# Altium project Counter_circuit.PrjPcb
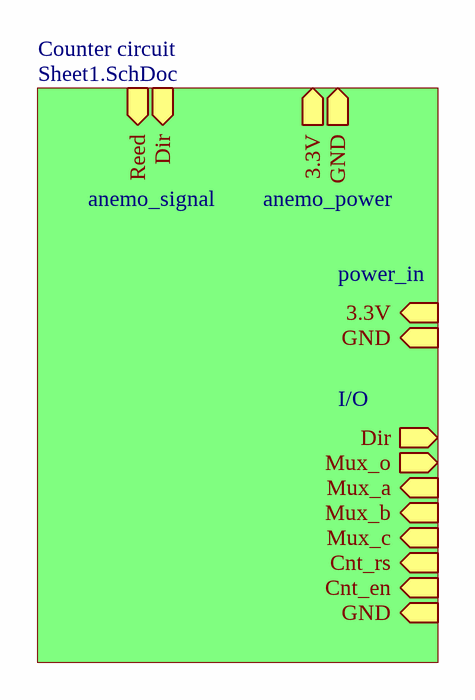
[diagram p0: Sheet2.SchDoc]
2 sheets, 36 parts. Net scope: hierarchical (ports join the sheet entries above them; power ports are global).
Board file: PCB1.PcbDoc
Sheets:
  Sheet2.SchDoc
    Counter circuit = Sheet1.SchDoc

## Sheet Sheet2.SchDoc: Counter circuit
size A4; ApprovedBy: alexander.marinsek@gmail.com; Author: Alexander Marinšek; Revision: 1.0; SheetNumber: 2; SheetTotal: 2

### Sub-sheets
Counter circuit = Sheet1.SchDoc: Mux_b (in), Mux_o (out), Dir (out), GND (out), Dir (in), 3.3V (in), Reed (in), Cnt_rs (in), 3.3V (out), Cnt_en (in), Mux_a (in), GND (in), Mux_c (in), GND (in)

### Nets
anemo_vcc: sheet Counter circuit/3.3V, sheet Counter circuit/3.3V
GND: sheet Counter circuit/GND, sheet Counter circuit/GND, sheet Counter circuit/GND
anemo_analog: sheet Counter circuit/Dir, sheet Counter circuit/Dir

### Notes on the sheet
- anemo_signal
- anemo_power
- power_in
- I/O
- Title
- Size:
- Date:
- A4
- Revision:
- Sheet
- of
- Author:
- Contact:

## Sheet Sheet1.SchDoc: Counter circuit
size A4; ApprovedBy: alexander.marinsek@gmail.com; Author: Alexander Marinšek; Revision: 1.0; SheetNumber: 1; SheetTotal: 2
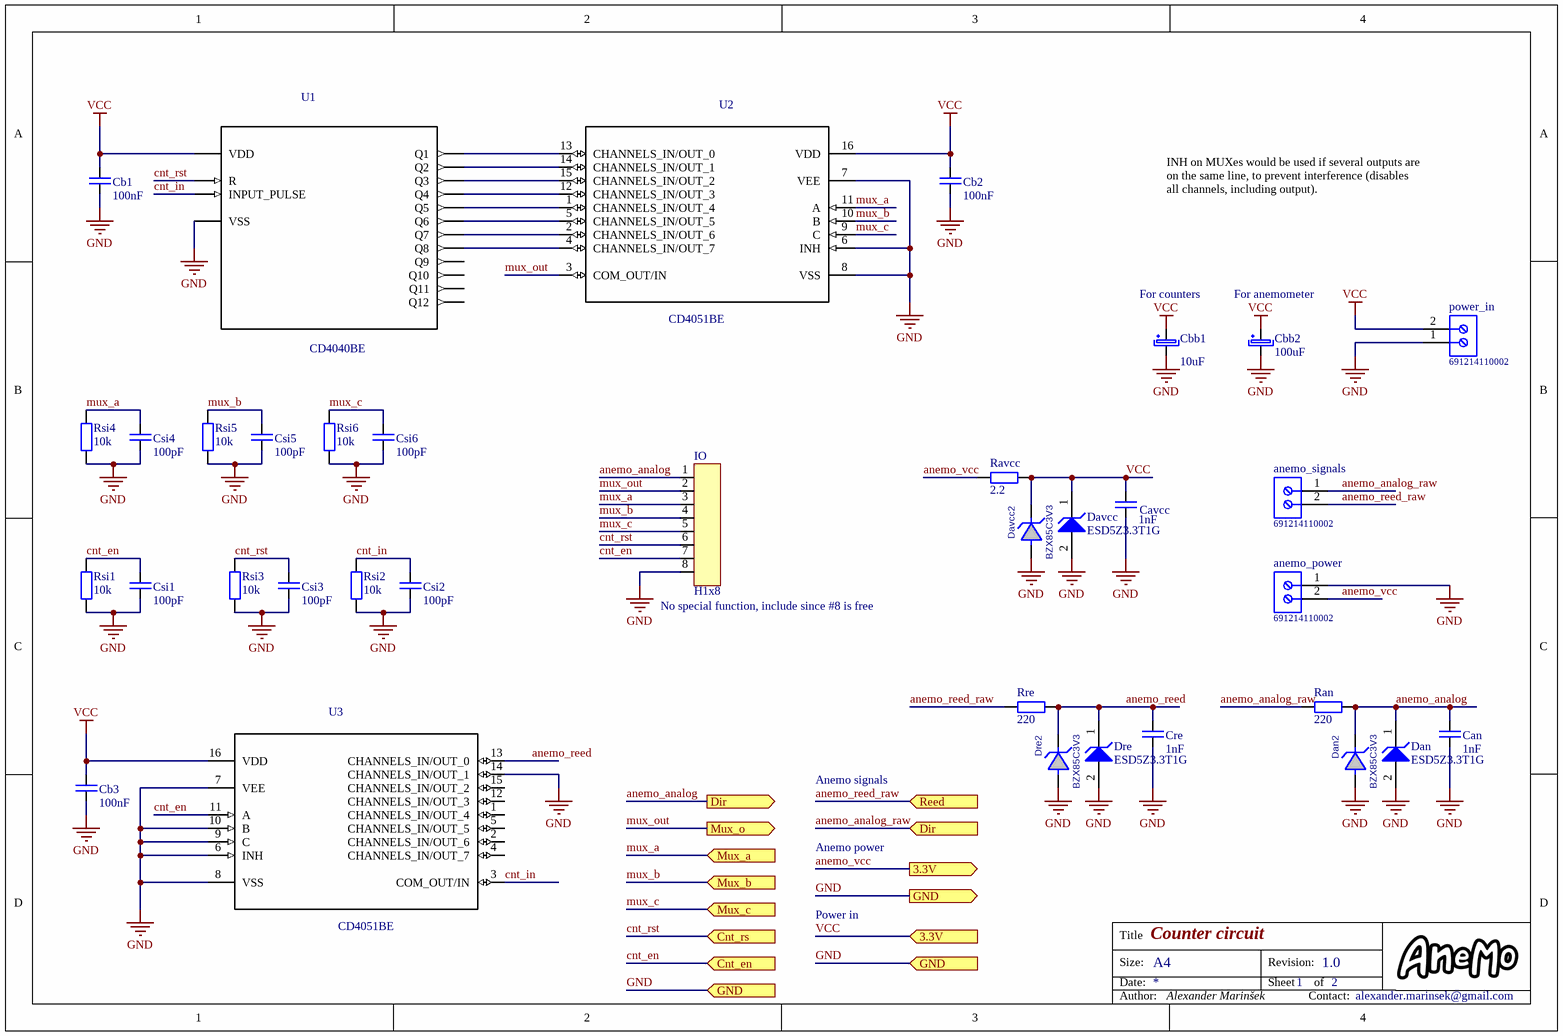
[diagram p1: Sheet1.SchDoc]

### Parts
anemo_power  691214110002  [691214110002]
anemo_signals  691214110002  [691214110002]
Can  1nF  [C0805(2012)_M]
Cavcc  1nF  [C0805(2012)_M]
Cb1  100nF  [C0805(2012)_M]
Cb2  100nF  [C0805(2012)_M]
Cb3  100nF  [C0805(2012)_M]
Cbb1  10uF  [C-SMD-ELKO-D]
Cbb2  100uF  [C-SMD-ELKO-D]
Cre  1nF  [C0805(2012)_M]
Csi1  100pF  [C0805(2012)_M]
Csi2  100pF  [C0805(2012)_M]
Csi3  100pF  [C0805(2012)_M]
Csi4  100pF  [C0805(2012)_M]
Csi5  100pF  [C0805(2012)_M]
Csi6  100pF  [C0805(2012)_M]
Dan  ESD5Z3.3T1G  [ONSC-SOD-523-2-502-01_V]
Dan2  BZX85C3V3  [DO 35 (300MILS)]
Davcc  ESD5Z3.3T1G  [ONSC-SOD-523-2-502-01_V]
Davcc2  BZX85C3V3  [DO 35 (300MILS)]
Dre  ESD5Z3.3T1G  [ONSC-SOD-523-2-502-01_V]
Dre2  BZX85C3V3  [DO 35 (300MILS)]
IO  H1x8  [H1x8]
power_in  691214110002  [691214110002]
Ran  220  [R0805(2012)_M]
Ravcc  2.2  [R0805(2012)_M]
Rre  220  [R0805(2012)_M]
Rsi1  10k  [R0805(2012)_M]
Rsi2  10k  [R0805(2012)_M]
Rsi3  10k  [R0805(2012)_M]
Rsi4  10k  [R0805(2012)_M]
Rsi5  10k  [R0805(2012)_M]
Rsi6  10k  [R0805(2012)_M]
U1  CD4040BE  [*SOIC16]
U2  CD4051BE  [*SOIC16]
U3  CD4051BE  [*SOIC16]

### Ports
3.3V (in), 3.3V (out), Cnt_en (in), Cnt_rs (in), Dir (in), Dir (out), GND (in), GND (out), Mux_a (in), Mux_b (in), Mux_c (in), Mux_o (out), Reed (in)

### Nets
anemo_vcc: anemo_power.2 Cavcc.1 Cb1.1 Cb2.1 Cb3.1 Cbb1.1 Cbb2.1 Davcc.1(K) Davcc2.K power_in.2 Ravcc.1 Ravcc.2 U1.16(VDD) U2.16(VDD) U3.16(VDD) ; port 3.3V  [also labelled VCC]
GND: anemo_power.1 Can.2 Cavcc.2 Cb1.2 Cb2.2 Cb3.2 Cbb1.2 Cbb2.2 Cre.2 Csi1.2 Csi2.2 Csi3.2 Csi4.2 Csi5.2 Csi6.2 Dan.2(A) Dan2.A Davcc.2(A) Davcc2.A Dre.2(A) Dre2.A IO.8 power_in.1 Rsi1.2 Rsi2.2 Rsi3.2 Rsi4.2 Rsi5.2 Rsi6.2 U1.8(VSS) U2.6(INH) U2.7(VEE) U2.8(VSS) U3.6(INH) U3.7(VEE) U3.8(VSS) U3.9(C) U3.10(B) U3.14(CHANNELS_IN/OUT_1) ; port GND
anemo_analog: anemo_signals.1 Can.1 Dan.1(K) Dan2.K IO.1 Ran.1 Ran.2 ; port Dir  [also labelled anemo_analog_raw]
anemo_reed: Cre.1 Dre.1(K) Dre2.K Rre.2 U3.13(CHANNELS_IN/OUT_0)
anemo_reed_raw: anemo_signals.2 Rre.1 ; port Reed
cnt_en: Csi1.1 IO.7 Rsi1.1 U3.11(A) ; port Cnt_en
cnt_in: Csi2.1 Rsi2.1 U1.10(INPUT_PULSE) U3.3(COM_OUT/IN)
cnt_rst: Csi3.1 IO.6 Rsi3.1 U1.11(R) ; port Cnt_rs
mux_a: Csi4.1 IO.3 Rsi4.1 U2.11(A) ; port Mux_a
mux_b: Csi5.1 IO.4 Rsi5.1 U2.10(B) ; port Mux_b
mux_c: Csi6.1 IO.5 Rsi6.1 U2.9(C) ; port Mux_c
mux_out: IO.2 U2.3(COM_OUT/IN) ; port Mux_o
NetU1_2: U1.2(Q6) U2.5(CHANNELS_IN/OUT_5)
NetU1_3: U1.3(Q5) U2.1(CHANNELS_IN/OUT_4)
NetU1_4: U1.4(Q7) U2.2(CHANNELS_IN/OUT_6)
NetU1_5: U1.5(Q4) U2.12(CHANNELS_IN/OUT_3)
NetU1_6: U1.6(Q3) U2.15(CHANNELS_IN/OUT_2)
NetU1_7: U1.7(Q2) U2.14(CHANNELS_IN/OUT_1)
NetU1_9: U1.9(Q1) U2.13(CHANNELS_IN/OUT_0)
NetU1_13: U1.13(Q8) U2.4(CHANNELS_IN/OUT_7)

Not connected (* = marked no-connect by the designer): U1 1(Q12) 12(Q9) 14(Q10) 15(Q11); U3 1(CHANNELS_IN/OUT_4) 2(CHANNELS_IN/OUT_6) 4(CHANNELS_IN/OUT_7) 5(CHANNELS_IN/OUT_5) 12(CHANNELS_IN/OUT_3) 15(CHANNELS_IN/OUT_2)

### Notes on the sheet
- INH on MUXes would be used if several outputs are on the same line, to prevent interference (disables all channels, including output).
- (near Cbb1) For counters
- (near Cbb2) For anemometer
- (near IO) No special function, include since #8 is free
- Anemo signals
- Anemo power
- Power in
- Title
- Size:
- Date:
- A4
- Revision:
- Sheet
- of
- Author:
- Contact:

### Library data of the parts
anemo_power anemo_signals power_in = 691214110002: Serie 2141 - 3.50 mm Horizontal Entry Modular with Rising Cage Clamp WR-TBL, 2 pin; Pin Number: 2; Pitch: 3.50 mm; ComponentLink1Description: Manufacturer; ComponentLink1URL: http://www.we-online.de; ComponentLink2Description: Datasheet; ComponentLink2URL: http://katalog.we-online.de/em/datasheet/6912141100xx.pdf; Part Number: 691214110002; Published Date: June 2018; Publisher: Wurth Elektronik; Operating Temperature: -40 to 105 degC; Mounting Technology: THT; Packaging: Box
Can Cavcc Cb1-Cb3 Cre Csi1-Csi6 = C: Capacitor
Cbb1 Cbb2 = C+: Capacitor Polarized
Dan Davcc Dre = ESD5Z3.3T1G: Transient Voltage Suppressor, Micro-Packaged Diode for ESD Protection, 2-Pin SOD-523, Pb-Free, Tape and Reel; Manufacturer: On Semiconductor; Direction: Unidirectional; IR Max (uA): 0.05; Number of Lines: 1; PPK Max (W): 158; V(BR) Min (V): 5; VRWM Max (V): 3.3; DatasheetVersion: Rev. 10; PackageVersion: Rev. E, 09/2010; PackageReference: SOD-523-2-502-01; PackageDescription: 2-Pin SOD, Body 1.2 x 0.8 mm; Supplier 1: Digi-Key; Supplier Part Number 1: ESD5Z3.3T1GOSTR-ND; Supplier 2: Digi-Key; Supplier Part Number 2: ESD5Z3.3T1GOSCT-ND; Supplier 3: Digi-Key; Supplier Part Number 3: ESD5Z3.3T1GOSDKR-ND; Supplier 4: Farnell; Supplier Part Number 4: 2317508; Supplier 5: Farnell; Supplier Part Number 5: 2317778; Supplier 6: Newark; Supplier Part Number 6: 41K9783; Supplier 7: Newark; Supplier Part Number 7: 10N9403; Supplier 8: Mouser; Supplier Part Number 8: 863-ESD5Z3.3T1G; Packing: Tape and Reel; RoHS: Pb-Free; Mounting Technology: Surface Mount; PartNumber: ESD5Z3.3T1G; ComponentLink1Description: Manufacturer URL; ComponentLink1URL: http://www.onsemi.com/; ComponentLink2Description: Datasheet; ComponentLink2URL: http://www.onsemi.cn/pub_link/Collateral/ESD5Z2.5T1-D.PDF; ComponentLink3Description: Package Specification; ComponentLink3URL: http://www.onsemi.com/pub_link/Collateral/502-01.PDF
IO = H1x8: Header 1x8 (male)
Ran Ravcc Rre Rsi1-Rsi6 = R
U1 = CD4040BE: Ic Counter Ripple Binary 12 Stage 16dil-300; MF: Texas Instruments; Availability: Unavailable; Package: PDIP-16 Texas Instruments; SnapEDA_Link: https://www.snapeda.com/parts/CD4040BE/Texas%20Instruments/view-part/?ref=snap; Price: None; MP: CD4040BE; Value: *
U2 U3 = CD4051BE: i/c Analg Mx/Dmx 8chan 4051_p_; MF: Texas Instruments; Availability: Unavailable; Package: DIP-16 Intersil; SnapEDA_Link: https://www.snapeda.com/parts/CD4051BE/Texas%20Instruments/view-part/?ref=snap; Price: None; MP: CD4051BE; Value: *
Dan2 Davcc2 Dre2 = BZX85C3V3: Value: *